# EAGLE board Schematic (EAGLE 6.4)
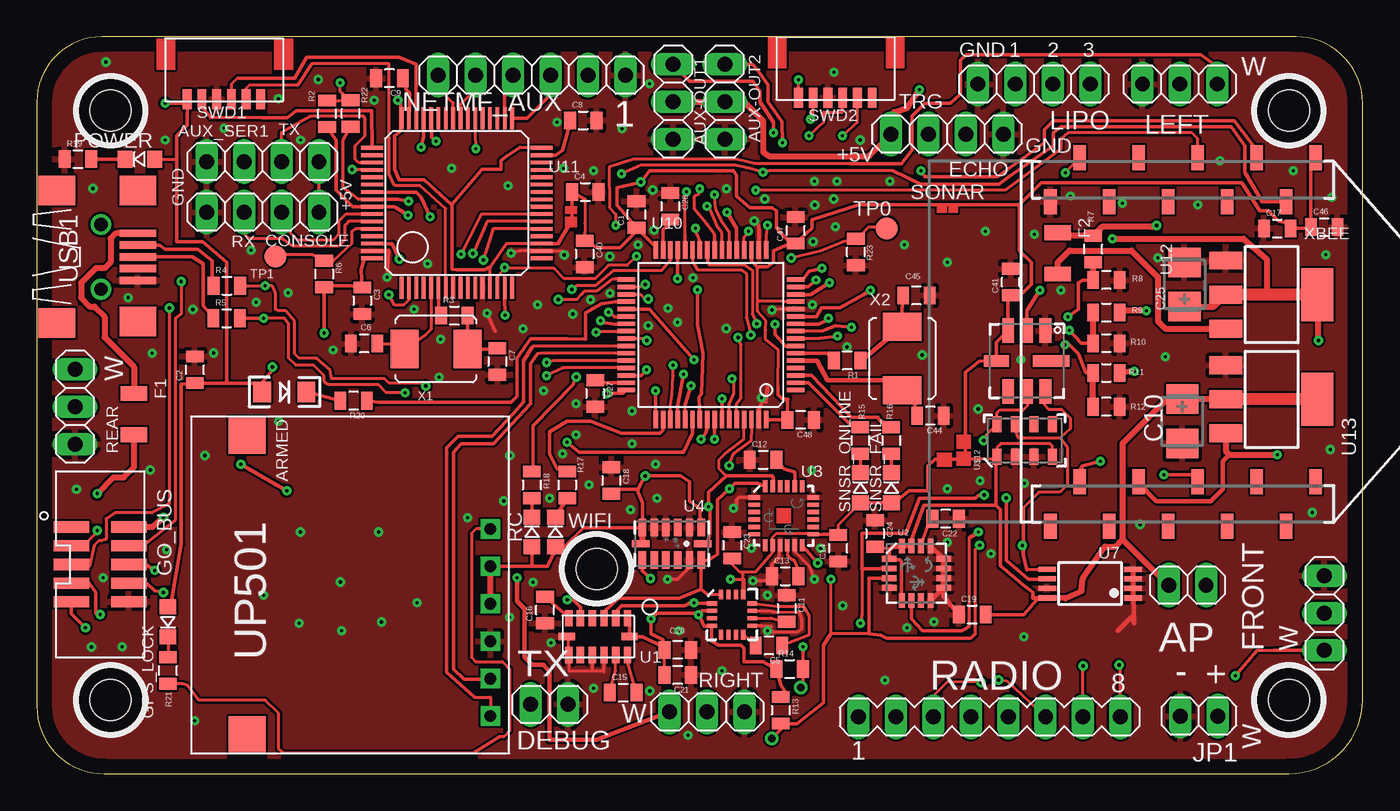
[diagram p2: board, top side]
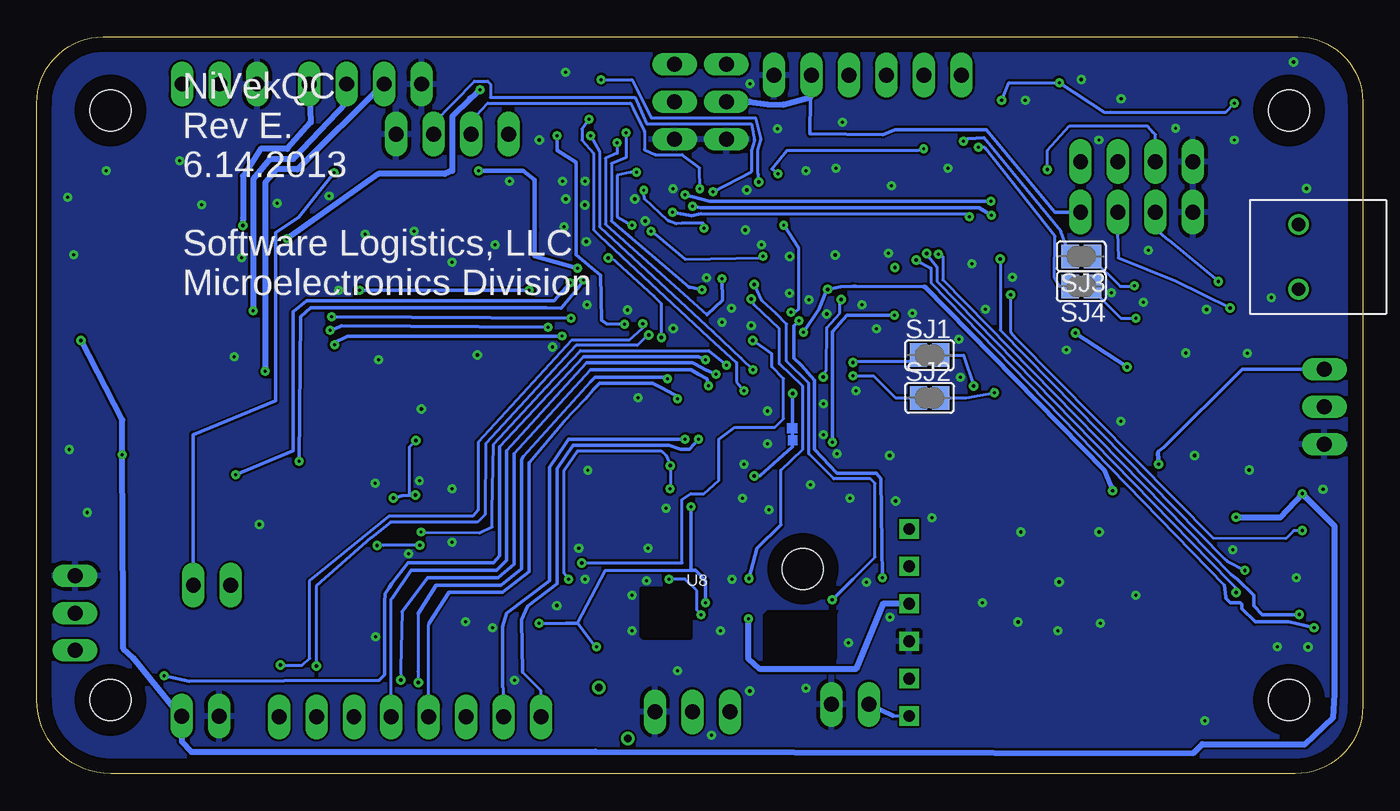
[diagram p3: board, bottom side, seen from below]

Size 90 x 50 mm. Coordinates in mm from the lower left corner, seen from the top.
Outline: 0,45.59 0,4.59 arc90 4.59,0 85,0 arc90 90,5 90,45.49 arc90 85.49,50 4.41,50 arc90 0,45.59
Copper layers (1*16): Top 0.035mm / dielectric 1.5mm / Bottom 0.035mm
Design rules "default": minimum track width 7mil, minimum drill 8mil, track to track 6mil, track to pad 6mil, pad to pad 6mil, via to via 6mil, smd to smd 6mil, copper to edge 40mil, drill to drill 8mil, minimum pad ring 10mil, minimum via ring 8mil, stop-mask expansion 4mil, vias tented up to drill 10mil, thermal gap 10mil
Holes 2.79 mm at 5,5 5,45 85,45 85,5 38,13.9

## Footprints (pad centres in the part's own frame; a part is rotated, then mirrored left to right if it is on the bottom)
1X02 = drill 1.016 long: 1 -1.27,0; 2 1.27,0
LED-1206 = smd 1.2 x 1.4: A -1.5,0; C 1.5,0
1X03 = drill 1.016 long: 1 -2.54,0; 2 0,0; 3 2.54,0
1X04 = drill 1.016 long: 1 -3.81,0; 2 -1.27,0; 3 1.27,0; 4 3.81,0
0805 = smd 0.8 x 1.2: 1 -0.9,0; 2 0.9,0
CT3528 = smd 2 x 2.2: + -1.5,0; - 1.5,0
1206L050_FUSE = smd 1 x 1.8: P$1 -1.4,0; P$2 1.4,0
PIN2ROW_0.05" = smd 2.4 x 0.76: 1 -1.95,2.54; 2 1.95,2.54; 3 -1.95,1.27; 4 1.95,1.27; 5 -1.95,0; 6 1.95,0; 7 -1.95,-1.27; 8 1.95,-1.27; 9 -1.95,-2.54; 10 1.95,-2.54
LED0805 = smd 1.143 x 1.016: C 0,1.016; P$1 0,-1.016
1X06 = drill 1.016 long: 1 -6.35,0; 2 -3.81,0; 3 -1.27,0; 4 1.27,0; 5 3.81,0; 6 6.35,0
MA08-1 = drill 1.016 long: 1 -8.89,0; 2 -6.35,0; 3 -3.81,0; 4 -1.27,0; 5 1.27,0; 6 3.81,0; 7 6.35,0; 8 8.89,0
SJ = smd 1.168 x 1.6: 1 -0.762,0; 2 0.762,0
JSTX6 = smd 0.6 x 1.35: 1 -2.495,-0.13; 2 -1.495,-0.13; 3 -0.495,-0.13; 4 0.505,-0.13; 5 1.505,-0.13; 6 2.505,-0.13
TP15R = smd 1.5 x 1.5: TP 0,0
LGA3X5X1-14L = smd 1.1 x 0.5: 1 -1.25,2; 2 -1.25,1.2; 3 -1.25,0.4; 4 -1.25,-0.4; 5 -1.25,-1.2; 6 -1.25,-2; 8 1.25,-2; 9 1.25,-1.2; 10 1.25,-0.4; 11 1.25,0.4; 12 1.25,1.2; 13 1.25,2 | smd 0.5 x 1.1: 7 0,-2.125; 14 0,2.125
LGA16-4X4 = smd 1 x 0.4: 1 -1.85,0.975; 2 -1.85,0.325; 3 -1.85,-0.325; 4 -1.85,-0.975; 9 1.85,-0.975; 10 1.85,-0.325; 11 1.85,0.325; 12 1.85,0.975 | smd 0.4 x 1: 5 -0.975,-1.85; 6 -0.325,-1.85; 7 0.325,-1.85; 8 0.975,-1.85; 13 0.975,1.85; 14 0.325,1.85; 15 -0.325,1.85; 16 -0.975,1.85
QFN-24 = smd 0.8 x 0.3: 1 -2,1.25; 2 -2,0.75; 3 -2,0.25; 4 -2,-0.25; 5 -2,-0.75; 6 -2,-1.25; 13 2,-1.25; 14 2,-0.75; 15 2,-0.25; 16 2,0.25; 17 2,0.75; 18 2,1.25 | smd 0.3 x 0.8: 7 -1.25,-2; 8 -0.75,-2; 9 -0.25,-2; 10 0.25,-2; 11 0.75,-2; 12 1.25,-2; 19 1.25,2; 20 0.75,2; 21 0.25,2; 22 -0.25,2; 23 -0.75,2; 24 -1.25,2
LGA14 = smd 0.5 x 1.2: 1 2,1.1; 2 1.2,1.1; 3 0.4,1.1; 4 -0.4,1.1; 5 -1.2,1.1; 6 -2,1.1; 8 -2,-1.1; 9 -1.2,-1.1; 10 -0.4,-1.1; 11 0.4,-1.1; 12 1.2,-1.1; 13 2,-1.1 | smd 1.2 x 0.5: 7 -2.1,0; 14 2.1,0
BMP085 = smd 1.67 x 0.8: 1 -2.065,1.27; 2 -2.065,0; 3 -2.065,-1.27; 5 2.065,-1.27; 6 2.065,0; 7 2.065,1.27 | smd 0.8 x 1.67: 4 0,-2.065 | smd 0.8 x 2.5: 8 0,1.65
TSSOP8 = smd 0.35 x 1.2: 1 -0.975,-2.925; 2 -0.325,-2.925; 3 0.325,-2.925; 4 0.975,-2.925; 5 0.975,2.925; 6 0.325,2.925; 7 -0.325,2.925; 8 -0.975,2.925
16LPCC = smd 0.65 x 0.28: 1 -1.37,0.75; 2 -1.37,0.25; 3 -1.37,-0.25; 4 -1.37,-0.75; 9 1.37,-0.75; 10 1.37,-0.25; 11 1.37,0.25; 12 1.37,0.75 | smd 0.28 x 0.65: 5 -0.75,-1.37; 6 -0.25,-1.37; 7 0.25,-1.37; 8 0.75,-1.37; 13 0.75,1.37; 14 0.25,1.37; 15 -0.25,1.37; 16 -0.75,1.37
STM32F051XXX_LPFP64 = smd 0.3 x 1.2: 1 -3.75,-5.75; 2 -3.25,-5.75; 3 -2.75,-5.75; 4 -2.25,-5.75; 5 -1.75,-5.75; 6 -1.25,-5.75; 7 -0.75,-5.75; 8 -0.25,-5.75; 9 0.25,-5.75; 10 0.75,-5.75; 11 1.25,-5.75; 12 1.75,-5.75; 13 2.25,-5.75; 14 2.75,-5.75; 15 3.25,-5.75; 16 3.75,-5.75; 33 3.75,5.75; 34 3.25,5.75; 35 2.75,5.75; 36 2.25,5.75; 37 1.75,5.75; 38 1.25,5.75; 39 0.75,5.75; 40 0.25,5.75; 41 -0.25,5.75; 42 -0.75,5.75; 43 -1.25,5.75; 44 -1.75,5.75; 45 -2.25,5.75; 46 -2.75,5.75; 47 -3.25,5.75; 48 -3.75,5.75 | smd 1.2 x 0.3: 17 5.75,-3.75; 18 5.75,-3.25; 19 5.75,-2.75; 20 5.75,-2.25; 21 5.75,-1.75; 22 5.75,-1.25; 23 5.75,-0.75; 24 5.75,-0.25; 25 5.75,0.25; 26 5.75,0.75; 27 5.75,1.25; 28 5.75,1.75; 29 5.75,2.25; 30 5.75,2.75; 31 5.75,3.25; 32 5.75,3.75; 49 -5.75,3.75; 50 -5.75,3.25; 51 -5.75,2.75; 52 -5.75,2.25; 53 -5.75,1.75; 54 -5.75,1.25; 55 -5.75,0.75; 56 -5.75,0.25; 57 -5.75,-0.25; 58 -5.75,-0.75; 59 -5.75,-1.25; 60 -5.75,-1.75; 61 -5.75,-2.25; 62 -5.75,-2.75; 63 -5.75,-3.25; 64 -5.75,-3.75
LQFP64 = smd 0.25 x 1.5: 1 -3.75,-5.75; 2 -3.25,-5.75; 3 -2.75,-5.75; 4 -2.25,-5.75; 5 -1.75,-5.75; 6 -1.25,-5.75; 7 -0.75,-5.75; 8 -0.25,-5.75; 9 0.25,-5.75; 10 0.75,-5.75; 11 1.25,-5.75; 12 1.75,-5.75; 13 2.25,-5.75; 14 2.75,-5.75; 15 3.25,-5.75; 16 3.75,-5.75; 33 3.75,5.75; 34 3.25,5.75; 35 2.75,5.75; 36 2.25,5.75; 37 1.75,5.75; 38 1.25,5.75; 39 0.75,5.75; 40 0.25,5.75; 41 -0.25,5.75; 42 -0.75,5.75; 43 -1.25,5.75; 44 -1.75,5.75; 45 -2.25,5.75; 46 -2.75,5.75; 47 -3.25,5.75; 48 -3.75,5.75 | smd 1.5 x 0.25: 17 5.75,-3.75; 18 5.75,-3.25; 19 5.75,-2.75; 20 5.75,-2.25; 21 5.75,-1.75; 22 5.75,-1.25; 23 5.75,-0.75; 24 5.75,-0.25; 25 5.75,0.25; 26 5.75,0.75; 27 5.75,1.25; 28 5.75,1.75; 29 5.75,2.25; 30 5.75,2.75; 31 5.75,3.25; 32 5.75,3.75; 49 -5.75,3.75; 50 -5.75,3.25; 51 -5.75,2.75; 52 -5.75,2.25; 53 -5.75,1.75; 54 -5.75,1.25; 55 -5.75,0.75; 56 -5.75,0.25; 57 -5.75,-0.25; 58 -5.75,-0.75; 59 -5.75,-1.25; 60 -5.75,-1.75; 61 -5.75,-2.25; 62 -5.75,-2.75; 63 -5.75,-3.25; 64 -5.75,-3.75
SOT223 = smd 1.219 x 2.235: 1 -2.311,-3.099; 2 0,-3.099; 3 2.311,-3.099 | smd 3.6 x 2.2: 4 0,3.099
UP-501 = drill 0.8 square: 1 -8.89,-8.89; 2 -6.35,-8.89; 3 -3.81,-8.89; 4 -1.27,-8.89; 5 1.27,-8.89; 6 3.81,-8.89 | smd 2.5 x 2.5: 7 10.16,7.62; 8 -10.16,7.62
MS5611-01BA = smd 1.1 x 0.6: 1 -1.1,1.875; 2 -1.1,0.625; 3 -1.1,-0.625; 4 -1.1,-1.875; 5 1.1,-1.875; 6 1.1,-0.625; 7 1.1,0.625; 8 1.1,1.875
USB-MB-S = smd 2.5 x 0.5: D+ 2.5,0; D- 2.5,0.8; GND 2.5,-1.6; ID 2.5,-0.8; VBUS 2.5,1.6 | smd 2.5 x 2: P$1 -3,-4.5; P$2 -3,4.5; P$3 2.5,-4.4; P$4 2.5,4.5 | drill 0.9: P$5 0,2.2; P$6 0,-2.2
ABRACON_ABM7_CERAMIC_XTAL = smd 1.9 x 2.6: P$1 -2.15,0; P$2 2.15,0
XBEE-SMD = smd 1.7 x 0.85: 1 -12.5,20; 2 -9.5,18; 3 -12.5,16; 4 -9.5,14; 5 -12.5,12; 6 -9.5,10; 7 -12.5,8; 8 -9.5,6; 9 -12.5,4; 10 -9.5,2; 11 12.5,2; 12 9.5,4; 13 12.5,6; 14 9.5,8; 15 12.5,10; 16 9.5,12; 17 12.5,14; 18 9.5,16; 19 12.5,18; 20 9.5,20

## Placement (x,y rotation side)
AP  [1X02]  78.1,12.8 0 top
ARMED  RED  [LED-1206]  16.8,25.9 0 top
AUX-OUT1  [1X03]  43.2,45.6 270 top
AUX-OUT2  [1X03]  46.7,45.6 270 top
AUX_SER1  [1X04]  15.34,41.54 180 top
C1  0.1uf  [0805]  40.71,37.95 90 top
C2  0.1uf  [0805]  10.73,27.41 90 top
C3  0.1uf  [0805]  22.09,32.09 270 top
C4  0.1uf  [0805]  37.24,39.47 0 top
C5  0.22uf  [0805]  49.7,8.7 180 top
C6  18pf  [0805]  22.22,29.19 180 top
C7  18pf  [0805]  31.26,27.97 270 top
C8  2.2uF  [0805]  37.09,44.33 0 top
C9  2.2uF  [0805]  23.94,47.19 180 top
C10  10uF  [CT3528]  77.76,23.91 270 top
C11  4.7uf  [0805]  50.9,11.2 270 top
C12  2.2nf (50v)  [0805]  49.3,21.3 0 top
C13  0.1uf  [0805]  50.8,13.4 0 top
C14  10nf  [0805]  54.4,15.3 90 top
C15  0.22uf  [0805]  39.8,5.5 0 top
C16  4.7uf  [0805]  34.5,11.1 90 top
C17  0.1uf  [0805]  84.2,37 0 top
C18  0.1uf  [0805]  39,19.9 270 top
C19  0.1uf  [0805]  63.5,10.8 0 top
C20  0.1uf  [0805]  43.5,8.4 180 top
C21  10uf  [0805]  43.5,6.7 180 top
C22  10nF(25V)  [0805]  61.7,17.3 180 top
C23  0.1uf  [0805]  47.2,15.5 270 top
C24  10uf  [0805]  56.9,16.3 270 top
C25  10uF  [CT3528]  77.9,33.2 90 top
C26  2.2uF  [0805]  43,38.5 270 top
C27  2.2uF  [0805]  37.9,25.8 270 top
C40  4.7uf  [0805]  37.19,35.26 270 top
C41  0.1uf  [0805]  66.11,33.36 90 top
C44  18pf  [0805]  60.66,24.29 180 top
C45  18pf  [0805]  59.71,32.45 180 top
C46  1.0uF  [0805]  87.39,37.09 0 top
C47  1.0uF  [0805]  51.51,36.87 90 top
C48  0.1uf  [0805]  51.85,24.01 180 top
CONSOLE  [1X04]  15.34,38.1 180 top
DEBUG  [1X02]  34.8,4.7 0 top
F1  1206L050_FUSE  [1206L050_FUSE]  6.6,24.4 270 top
F2  1206L050_FUSE  [1206L050_FUSE]  69.3,35.3 270 top
FRONT  [1X03]  87.4,10.9 90 top
GO_BUS  GO!BUS  [PIN2ROW_0.05"]  4.3,14.2 0 top
GPS_LOCK  BLUE  [LED0805]  8.9,10.3 180 top
JP1  [1X02]  78.89,3.91 180 top
LEFT  [1X03]  77.6,46.8 180 top
LIPO  [1X04]  67.7,46.8 180 top
NETMF_AUX  [1X06]  33.6,47.4 180 top
POWER  ORANGE  [LED0805]  7,41.7 90 top
R1  390  [0805]  55.02,28.04 180 top
R2  10K  [0805]  19.71,44.78 90 top
R3  390  [0805]  28.35,31.09 0 top
R4  22  [0805]  12.9,33.11 0 top
R5  22  [0805]  12.89,30.91 0 top
R6  10K  [0805]  19.5,33.9 270 top
R7  50K  [0805]  71.7,35.6 90 top
R8  10K  [0805]  72.6,33.5 180 top
R9  30K  [0805]  72.6,31.3 0 top
R10  10K  [0805]  72.6,29.2 180 top
R11  10K  [0805]  72.6,27.2 0 top
R12  10K  [0805]  72.6,24.9 180 top
R13  4.7K  [0805]  50.5,4.3 270 top
R14  4.7K  [0805]  51.1,7.1 0 top
R15  470  [0805]  55.9,22.6 270 top
R16  470  [0805]  58,22.6 270 top
R17  470  [0805]  36,19.6 270 top
R18  470  [0805]  33.6,19.6 270 top
R19  470  [0805]  2.8,41.7 0 top
R20  470  [0805]  21.5,25.3 180 top
R21  470  [0805]  8.9,7 90 top
R22  10K  [0805]  21.3,44.8 90 top
R23  10K  [0805]  55.6,35.4 90 top
RADIO  [MA08-1]  64.67,3.86 0 top
RC  BLUE  [LED0805]  33.6,16.4 0 top
REAR  [1X03]  2.6,24.9 270 top
RIGHT  [1X03]  45.5,4.2 0 top
SJ1  [SJ]  29.4,28.4 0 bottom
SJ2  [SJ]  29.4,25.5 0 bottom
SJ3  [SJ]  19.1,35.1 180 bottom
SJ4  [SJ]  19.1,33.07 180 bottom
SNSR_FAIL  RED  [LED0805]  58,19.4 0 top
SNSR_ONLINE  BLUE  [LED0805]  55.9,19.4 0 top
SONAR  [1X04]  61.8,43.4 180 top
SWD1  JST-6PIN  [JSTX6]  12.7,45.9 0 top
SWD2  SWD-STM32F0  [JSTX6]  54.2,46 0 top
TP0  TPTP15R  [TP15R]  57.7,37 0 top
TP1  TPTP15R  [TP15R]  16.2,35.1 0 top
U1  LSM303DLHC  [LGA3X5X1-14L]  38.1,9.3 270 top
U2  L3G4200D  [LGA16-4X4]  59.7,13.6 0 top
U3  ITG-3200  [QFN-24]  50.7,17.5 0 top
U4  ADXL345  [LGA14]  43.1,15.6 0 top
U5  BMP085  [BMP085]  67.2,28 270 top
U7  24AA128ST  [TSSOP8]  71.5,12.9 90 top
U8  HMC5883LSMD  [16LPCC]  47.2,10.8 0 top
U10  STM32F051XXX  [STM32F051XXX_LPFP64]  45.76,29.78 90 top
U11  STM32F40X  [LQFP64]  28.51,38.72 0 top
U12  LM1117MP-3.3  [SOT223]  83.82,32.51 270 top
U13  LM1117MP-3.3  [SOT223]  83.82,25.4 270 top
U$4  UP501  [UP-501]  21.9,12.8 90 top
U$12  MS5611-01BA  [MS5611-01BA]  67.06,22.61 90 top
USB1  DX2R005HN2E700  [USB-MB-S]  4.36,35.07 0 top
WIFI  GREEN  [LED0805]  35.2,16.4 0 top
X1  ABRACON_ABM7  [ABRACON_ABM7_CERAMIC_XTAL]  27.1,28.81 0 top
X2  ABRACON_ABM7  [ABRACON_ABM7_CERAMIC_XTAL]  58.74,28.17 90 top
XBEE  XBEE-1B3  [XBEE-SMD]  66.8,29.3 270 top

## Tracks (layer width: path | path; a pad name or v marks a point on that pad's centre or on a via)
+3V3  (via drill 0.2, 0.23)
  Top 0.2: 47.9,13.7 47.95,13.45 U8.13 47.97,12.17 48,12.2 48,13.2 v47.1,13.2 | 47.9,13.7 48.8,13.7 50,15.1 50,15.45 U3.8 49.95,16.05 50.2,16.3 52.65,16.3 U3.13 53.35,16.25 | C23.2 47.1,14.3 47.7,13.7 47.9,13.7 | 40.71,37.09 C1.1 40.71,36.81 | 10.2,44.8 SWD1.1 10.2,45.7 10,45.5 v8.7,45.5 | SWD2.1 51.7,46.99 v51.7,47.1 | SNSR_FAIL.P$1 58,18.2 | 8.83,11.33 8.9,11.4 GPS_LOCK.P$1 | R2.2 20.48,45.68 R22.2 20.6,46.3 v20.6,46.9 | 37.2,38.98 37.2,37.36 C40.1 37.2,36.25 37.2,36.2 37.3,36.2 | U10.32 42.01,35.75 | 37.2,16.7 37.1,16.7 35.78,15.38 WIFI.P$1 35.21,15.39 35.31,15.39 | 45.15,11.05 v44.9,10.8 | C21.2 42.6,8.3 | C24.2 57.7,15.3 57.85,15.15
  Top 0.203: 50.3,26.3 50.34,28.75 49.45,29.49 49.47,30.1 49.48,30.73 48.92,31.39 48.92,32 | 48.92,32 48.92,34.38 48.9,34.4 | 68.03,11.93 67.6,11.9 67.9,11.8 | POWER.P$1 9.5,41.7 | U11.19 31.87,35.97 30.8,34.4 30.76,34.24 U11.13 | C14.2 54.4,16.88 SNSR_ONLINE.P$1 | 50,34.7 49.99,34.7 49.97,34.69 | 50.69,32.05 48.97,32.05 48.92,32 | U$12.4 68.93,22.25 68.78,22.4 65.43,22.4 65.18,22.15 U$12.1 65.18,21.46 65.1,21.38 | 63.07,21.31 63.06,21.33 63.05,21.34 63.05,21.79 63.04,21.79
  Top 0.24: C47.1 51.23,35.97 50.2,37 50.2,38.2 49.9,38.4 48.4,38.4 47.5,39.2 47.5,40.6 47.3,40.9 | C47.1 51.01,35.91 50,35.5 50,34.7 | 50.69,32.05 U10.13 | 32.79,42.5 U11.32 | 22.2,34.9 22,34.18 C3.1 | C48.2 49.71,24.01 | U10.64 49.53,24.01 49.71,24.01 | C4.1 37.2,38.98 | C20.2 42.9,8.3 42.6,8.3 42.5,8.6 41.1,9.3 | U$4.5 33.6,14.07 34.67,14.07 35.31,15.39 | U4.6 37.2,16.7 | U2.15 59.38,15.88 60.2,18.2 64.3,18.2 | 65.4,17.9 65.4,14.1 67.1,12.7 67.2,12.6 67.6,12.3 67.6,11.9 67.9,11.8 67,10.8 65.1,10.8 C19.2 | 63.04,21.79 63.04,21.89 63.04,24.1 63.04,27.25 63.35,27.49 63.98,28 64.9,28.05 65.1,28 U5.4 | U5.3 65.93,32.28 C41.1 66.15,32.5 66.8,32.5 67.5,33.2 67.5,34.7 66.7,35.5 66.7,38.6 55.8,38.6 52.6,37.6 52.6,37 51.5,36 C47.1 | 44.3,19.8 43.7,20.2 v41.3,20.2 40.8,19.3 38.8,19.3 C18.2 | 49.5,23.8 49.71,24.01 | 45.8,10 45.8,9 46.3,8.7 47.8,8.7 48,8.5 48,7.6 49.3,7.6 R14.1 50.5,6 51,5.3 R13.1 | 50.3,26.3 50.3,25.7 50.6,25.4 51,25.4 | 53.35,16.25 53.95,16.25 C14.2 | 44.9,10.9 42.1,10.9 v41.7,10.5
  Top 0.254: 41.1,9.3 U1.14 40.23,10.43 U1.1 | 45.78,10 45.3,10 44.9,10.9 45.15,11.05 U8.2 | 45.8,10 45.78,10 | 45.78,10 U8.4 | U4.6 41.1,18.4 40.8,19.1 40.8,19.3 | 44.3,19.8 44.3,18.5 45,18 45,17.4 45.1,17.3 U4.1 | U5.4 65.14,29.27 U5.3 | U11.19 35.37,35.97 36.32,37.58 C4.1 36.4,39.33 | 66.7,38.6 68.2,40.1 81.7,40.1 81.8,40.1 83,38.2 83.6,38.2 84.3,37.5 84.8,37.4 85.1,36.9 C17.2 | v41.7,10.5 41.7,9.5 42.5,9.1 42.5,8.6 | C48.2 50.95,25.35 51,25.4 | SNSR_ONLINE.P$1 SNSR_FAIL.P$1 | RC.P$1 33.6,14.07 | 40.71,37.09 39.4,38.56 39.4,39.76 39.5,39.8 v41,40.15 41.6,40.9 43.1,40.9 44.4,40.9 45.6,40.9 45.9,40.9 46.6,40.9 47.3,40.9 | 58,18.2 59.2,19.2 60.5,19.2 60.5,20.88 60.96,21.34 63.05,21.34 | 40.71,36.81 39.6,35.7 38.1,35.7 38,35.7 37.3,36.2 | 42.01,35.75 C1.1 | 32.79,42.5 31.9,41.9 31.6,41.7 31.5,41.6 31.5,41 30.24,41 28.16,38.62 | U7.8 68.03,11.93 67.78,11.93 | v24.5,45.7 24.7,45.5 24.7,44.5 24.73,44.5 U11.48 24.7,44.41 24.7,43.6 24.3,43.3 24.3,41 24.6,40.3 25.3,40.3 26.3,40.3 28.16,38.62 | U11.64 22.67,34.97 22.2,34.9 | 8.9,11.4 9.1,11.4 9.8,15.6 9.8,26.44 C2.1 12.9,26.51 | C17.2 86.4,37 C46.1 86.49,41.49 XBEE.1 | C17.2 | 65.4,17.9 65.1,18.2 | 65.1,18.2 65.1,19.35 65.1,21.38 63.06,21.33 | 64.3,18.2 64.9,18.2 65.1,18.2 | 28.16,38.62 28.2,38.6 28.2,34.24 28.5,34.2 30.4,34.2 30.8,34.4 | 19.6,33 19.5,32.8 19.5,31.4 19.5,30.8 19.5,30.6 v19.5,29.89 | 19.6,33 19.8,33 | 19.6,33 | 19.8,33 19.5,33.1 | 19.5,33.1 19.4,33.1 | R6.2 19.2,33 19.8,33 | 19.5,33.1 21.3,33.1 C3.1 | 10.2,44.7 10.2,44 9.5,43.3 9.5,41.7 9.49,41.4 9.49,36.1 11.25,36.1 12.9,34.7 12.9,29.2 12.9,26.51 | 10.2,44.7 10.2,44.8 10.2,44.7 | 10.2,44.7
  Top 0.254: U2.5 58.7,11.75 58.7,14.4 58.6,14.5 58,14.5 57.9,14.6 57.88,14.6 U2.1 | v38.7,25.8 39.8,25.8 40.01,26.01 U10.48 | 12.9,26.51 15.27,26.51 | 15.27,26.51 ARMED.A | 15.27,26.51 15.97,27.37 v16,27.6 | U10.19 48.51,34.79 48.9,34.4 49.6,34.4 49.97,34.69
  Top 0.305: U2.1 57.85,15.15 58.1,15.4 58.67,15.4 U2.16 U2.15
  Top 0.406: 86.7,41.7 XBEE.1 | 10.5,26.38 C2.1 | U7.8 69.85,11.9 70.91,12.38 71.01,13.25 72.5,15.4 73.2,15.4 73.7,15.9 | U$4.4 U$4.5 | U4.7 41.1,15.6 41.1,16.6 | 41.1,16.6 | 41.1,16.6 U4.6 | U13.2 77.8,25.4 | 77.8,25.4 | 77.8,25.4 77.7,25.3 76.6,25.3 73.7,22.4 73.7,15.9 | C10.+ 77.79,25.41 77.8,25.4 | 73.7,15.9 | 73.7,15.9 76.8,12.8 AP.1
  Top 0.813: U13.4 U13.2
  Bottom 0.2: v51.7,47.1 49.6,47.1 48.3,44.5 41.2,44.5 40.85,43 | v20.6,46.9 17.55,44.9 17.1,44.9 9.3,44.9 v8.7,45.5 | v44.9,10.8 45.2,11.1 45.2,12.4 46,13.2 v47.1,13.2
  Bottom 0.203: v24.5,45.7 24,46.9 20.7,46.9 v20.6,46.9 | v41,40.15 41,40.64 41.05,40.69 41.05,42.35 40.85,43
  Bottom 0.254: v41.3,20.2 40.9,20.2 38.7,22.2 38.7,25.6 38.9,25.8 v38.7,25.8 | v16,27.6 v19.5,29.89
  Bottom 0.406: U$4.4 32.57,11.53 34.4,7.1 40.9,7.1 41.7,7.8 v41.7,10.5
+5V  (via drill 0.2, 0.23)
  Top 0.2: SONAR.4 57.99,44.09
  Top 0.203: SONAR.4 | SONAR.4 | XBEE.14 74.8,19.7 | CONSOLE.1 19.15,41.45 19.2,41.5 19.19,41.5 AUX_SER1.1
  Top 0.254: AUX-OUT2.2
  Top 0.305: 74.8,19.7 76,18.5 79.7,18.5 80.5,19.3 80.5,21.2 80.95,21.65
  Top 0.406: v73,36.3 81.9,36.3 83.5,34.9 83.5,32.71 83.7,32.51 | 57.99,44.09 58.2,44.9 59.1,45.2 v59.9,46.4 | v4.1,19 5.2,20.1 5.9,20.1 6.6,20.8 F1.P$2 | AUX-OUT1.2 AUX-OUT2.2 48,45.6 49.3,44.3 49.3,42.2 49.7,41.9 56.5,41.9 SONAR.4 | GO_BUS.2 7.85,16.75 v8.6,17.4 | v4.1,19 | C25.+ 79.91,31.7 U12.2 | v87,29.4 87,32.43 U12.4 | U13.3 80.72,21.88 80.95,21.65 v84.2,21.66 | F1.P$2
  Top 0.813: U12.4 83.7,32.51 U12.2 | U12.2 80.7,32.5 U12.2
  Bottom 0.254: CONSOLE.1 19.4,38.1 20.9,38.1 21.4,38.7 25.55,43.7 26.5,43.7 27.5,43.7 30,43.7 31.75,43.7 32.55,43.37 37.5,43.42 37.5,45.8 37.5,45.9 | 37.5,47.4 37.5,47.3 37.47,47.33 NETMF_AUX.2
  Bottom 0.406: v73,36.3 66.8,40.7 62.3,40.7 61.8,40.9 61.8,44.6 60.6,45.8 v59.9,46.4 | AUX-OUT1.2 41.9,45.6 42.12,45.61 41.62,45.61 40.39,45.41 39.35,45.4 37.5,45.9 37.5,47.3 37.5,47.37 NETMF_AUX.2 | v8.6,17.4 5.6,17.4 v4.1,19 1.9,16.8 1.9,5.4 2,3.8 3.9,2 10.9,2 11.5,1.4 52.1,1.5 57.13,1.49 57.16,1.47 79.5,1.47 80.16,2.18 JP1.1 80.16,3.8 80.14,3.77 83.47,7.86 84.13,8.49 84.14,11.11 v84.2,21.66 84.2,24 v87,29.4
+5VREG
  Top 0.406: USB1.VBUS 5.37,36.67 5,36.3 5,34.7 4.6,34.3 4,34.3 3,33.3 3,32.3 3.6,31.7 3.9,31.7 4.6,31 4.6,29.6 6.6,27.6 F1.P$1 | 6.6,25.7 F1.P$1 | F1.P$1
ADC_CELL1  (via drill 0.2)
  Top 0.24: R11.1 71.2,27.2 70.7,28.5 69.9,29.3 v69.8,29.1 | v54.35,29.7 53.15,29.55 U10.8
  Top 0.406: R12.2 R11.1
  Bottom 0.24: v69.8,29.1 69.9,29.2 68.9,29.7 v54.35,29.7
ADC_CELL2  (via drill 0.2)
  Top 0.24: R10.2 70.9,29.2 v70.1,30.1 | v55.3,30.3 54.22,30.4 53.37,30.05 U10.9
  Top 0.406: R9.1 R10.2
  Bottom 0.24: v70.1,30.1 70.2,30 69.3,30.4 v55.3,30.3
ADC_CELL3  (via drill 0.2)
  Top 0.24: R8.2 71,33.5 70.7,33.3 70.7,31.5 v70,31 | v53.75,30.9 53.6,30.8 53.56,30.75 53.06,30.5 51.51,30.51 | U10.10 51.51,30.51 | 51.51,30.51 51.5,30.5
  Top 0.406: R7.1 R8.2
  Bottom 0.24: 70.2,31 v70,31 v53.75,30.9
ADXL_IRQ  (via drill 0.23)
  Top 0.203: v41.5,32.2 41.3,32.2 41,32.5 40.04,32.5 U10.35
  Top 0.254: U4.8 | U4.8 41.1,13.77 v41.66,13.25
  Bottom 0.203: 39.5,16.9 39.5,20.6 38,22 38,26.3 39.6,27.8 39.6,30.2 41.3,31.8 v41.5,32.2
  Bottom 0.254: v41.66,13.25 41.1,15.3 39.5,16.9
BMP_EOC  (via drill 0.2)
  Top 0.254: U5.2 67.2,31.4 v68.1,32.8 | v56.6,32.8 56.1,32.5 54.5,31.6 53.25,31.6 52.91,31 51.54,31 U10.11
  Bottom 0.254: v68.1,32.8 v56.6,32.8
F0_RESET  (via drill 0.2)
  Top 0.2: 55.7,44.2 SWD2.5
  Top 0.203: 55.7,44.2 v54.7,43.3
  Top 0.24: v50.1,30.5 50.1,29.8 50.81,29 51.48,29 U10.7
  Bottom 0.24: v54.7,43.3 54.7,42.3 53.4,41.5 53.4,35.2 51.73,33.83 51.66,30.79 51.32,30.52 v50.1,30.5
F0_SWCLK  (via drill 0.2)
  Top 0.2: v52.5,44.4 52.7,44.6 52.7,45.8 | 52.7,45.8 52.7,45.9 | SWD2.2 52.7,45.8
  Top 0.24: v42,26 U10.49
  Bottom 0.2: 51.8,36.5 44.4,29.6 42.5,27.9 42.5,26.6 v42,26
  Bottom 0.203: v52.5,44.4 53,43.74 53,43 52.2,42.1 52.2,36.9 51.8,36.5
F0_SWDIO  (via drill 0.2)
  Top 0.2: 53.4,44.9 54.7,44.9 SWD2.4
  Top 0.203: 53.4,44.9 53.4,44.2 v52.4,43.3
  Top 0.24: v41.4,27.4 41,27 40.04,27 U10.46
  Bottom 0.2: 51.8,37.1 44.1,30 42.2,28.2 v41.4,27.4
  Bottom 0.203: v52.4,43.3 51.8,42.2 51.8,37.1
F4_DBG_IN  (via drill 0.23)
  Top 0.2: U11.59 21.17,37.47 21.1,37.4 20.9,37.2 20.9,36.4 20.9,36.2 20.5,35.8
  Top 0.203: 20.5,35.8 17.4,35.8 16.7,36.3 14.4,36.3 14,36.7 14.07,36.77 CONSOLE.3 | v9.8,33.4 9.8,31.2 9.4,30.9 9.4,17.2 7.5,15.7 6.2,15.4 6.2,15.42 GO_BUS.4
  Bottom 0.203: v9.8,33.4 13.15,36.2 14,36.9 14,38.03 CONSOLE.3
F4_DBG_OUT  (via drill 0.23)
  Top 0.203: v9,31.6 9,18.3 7.8,17.7 5.3,17.7 4.7,17.3 4.7,15.9 4.4,15.8 4.2,15.8 3.9,15.5 3.6,14.1 2.5,14.1 | 2.5,14.1 2.4,14.1 2.3,14.2 | GO_BUS.5 2.4,14.2 2.5,14.1 | U11.58 20.97,37.97 20.5,37.5 20.5,36.6 20.1,36.2 17.7,36.2 17.2,36.7 17.2,37.5 CONSOLE.2 | CONSOLE.2
  Bottom 0.203: v9,31.6 12.72,33.44 16.6,35.01 16.64,36.74 16.64,38.07 CONSOLE.2
F4_RESET#
  Top 0.203: U11.7 27.76,38.34 26,39.9 24.3,39.9 23.9,40.7 23.9,48.2 18.7,48.2 17.7,46.7 14.4,46.7 14.2,46.5 SWD1.5
F4_SWCLK
  Top 0.2: 15.3,44.5 11.8,44.5 11.2,45.3 SWD1.2 | 11.2,45.8 SWD1.2 | SWD1.2
  Top 0.24: 15.3,44.5 16.4,44.5 17,44.5 17.4,44.8 17.6,45 22.73,45 U11.49
F4_SWDIO
  Top 0.2: 13.7,47.2 13.6,47.2 13.2,46.8 SWD1.4
  Top 0.24: U11.46 25.76,48.14 24.6,48.6 18.3,48.6 17.5,47.2 13.7,47.2
GND  (via drill 0.2, 0.23)
  Top 0.2: 50.4,14.7 50.4,14.95 50.5,15.45 U3.9 | 36,35.4 35.77,35.47 U11.18 32.77,35.47 v32.2,35.3 | U8.11 49.75,11.05 50,11 51.75,10.95 51.9,10.5 51.9,9.8 51.6,9.6 50,9.6 | v49.6,9.7 49.9,10 49.2,10 | U1.7 36,9.3 36.1,9.2 U1.8 36.1,7 37.7,7 | 37.7,7 38.4,7 38.5,6.9 U1.11 | U1.10 37.7,7
  Top 0.203: U3.11 51.45,15.05 52,14.5 52.4,14.1 v52.8,13.2 | U10.12 49.96,31.53 v49.9,31.47
  Top 0.24: 31.1,30.03 v30.58,31.25 | U11.63 23.87,35.47 v23.78,33.68 | U3.1 47.65,18.75 47.5,18.6 47.5,18.2 v47.3,18
  Top 0.254: U10.63 49,24.7 49.6,25.9 49.6,26.3 49.5,25.2 v49.2,25.5 | v48.6,13.1 49.8,13.1 49.9,13.3 49.9,14.2 50.4,14.7 | v42.8,13.2 43.5,13.2 44.3,14 U4.12 | U4.12 | U8.9 49.15,10.05 49.2,10 | 49.2,10 | 49.2,10 | v49.6,9.7 49.9,9.7 50,9.6 | U10.18 49.01,37.19 v48.7,37.5
  Top 0.305: 73.39,9.71 74.29,10.61 74.5,10.2 U7.1 U7.2 U7.3 U7.4 | U2.8 U2.9 | U2.9 U2.10 U2.11 U2.12 U2.13 | U2.9 61.55,12.05 C19.1 | 47.9,3.24 RIGHT.3
  other vias: 20.7,9.7 40.3,17.9 17.9,43 7.85,28.52 26.52,34.6 42.1,18.7 46.8,39.7 35.75,41.07 61.8,19.33 64.4,36.8 61.8,15.7 59.06,9.9 17.8,10.2 44.2,2.6 49.6,12.1 57.9,40.2 54.2,37.1 58.9,35.9 32,39.9 14.9,32 54.1,47.6 29.24,17.37 32.1,10.6 34.9,8.9 37.8,5.8 33.7,13 27.3,26.9 80.3,41.6 85.3,40.9 40.8,35.9 43.49,30.64 54.3,40.2 70.14,39.2 78.8,38.6 61.8,34.7 76.6,28.3 87.5,35.2 8.7,43 16.4,23.9 15.4,12.1 37.5,19.6 34,31.83 40.4,22.4 42,21 43.6,9.7 46.5,7 67.02,19.7 12.7,43.8 14.55,35.5 17.05,32.63 20.1,28.75 55.9,43 23.2,16.4 20.6,13 74.9,16.9 86.58,17.71 87.8,22 3.7,8.6 5.8,8.6 2.7,19.3 49.4,39 54.1,39 41.8,39.6 37.79,40.91 42.85,31.59 38.9,35.1 35.8,35.2 41.6,5.6 54.7,11.4 16.4,45.8 19.1,47.1 22.9,45.7 6.2,32.3 10.6,31.5 12,28.54 54.99,28.96 60.1,28.4 63.9,24.75 23.4,10.3 67,9.3 60.9,10.3 64.75,14.91 41.5,30.4 46.8,30.2 53.2,15.3 52.7,36.1 52.8,38.6 52.8,40.2 44.54,33.64 34.4,26 76.1,35 73.7,38.7 40.4,24.6 52.6,20.6 48.5,15.3 33,30.2 37.6,32.15 38.9,32.6 36.6,23 35.7,21.7 36.6,25.1 34.8,18.7 25.6,31.5 27.4,29.5 4.5,13.3 8.8,15.2 41.9,36.9 35.3,44.2 87.9,39.1 69.5,32.8 67.7,36.6 66.8,28.1 3.8,39.7 4.7,48.3 17.9,16.4 25.8,11.6 10.7,3.6 11.4,21.6 7.7,20.6 39.71,43.76 28.14,41.07 31.7,18.5 32.1,21.6 41.59,46.81 52.66,31.8 57.58,6.34 64.03,19.89 36.37,31.19
  pour Top: 0.5,49.4 89.4,49.5 89.8,0.5 0.4,0.9 0.5,4.1
  pour Bottom: 0.7,49.3 89.4,49.3 89.4,0.6 0.4,0.8 0.4,1.3
GO_IRQ  (via drill 0.23)
  Top 0.203: U11.2 25.26,32.16 24.9,31.8 24.3,31.8 v23.9,32.5 | GO_BUS.3 3.17,15.47 3.9,16.2 v4.1,16.5
  Bottom 0.203: v23.9,32.5 23.9,30 23.5,29.5 10.14,15.99 5.23,15.95 4.68,16.5 v4.1,16.5
GO_MISO  (via drill 0.23)
  Top 0.203: U11.22 30.57,37.47 v29.6,35.3
  Top 0.254: v8.6,12.3 8,12.4 7.5,12.9 6.28,12.9 GO_BUS.8
  Bottom 0.203: v29.6,35.3 28.9,34.4 28.9,33.4 9,13 8.6,12.6 v8.6,12.3
GO_MOSI  (via drill 0.23)
  Top 0.203: U11.23 30.17,37.97 v28.8,35.25
  Top 0.254: GO_BUS.7 3.57,12.93 4,12.3 4,10.9 v4.3,10.8
  Bottom 0.203: v28.8,35.25 28.5,35.1 28.5,33.5 8.9,13.5
  Bottom 0.254: 8.9,13.5 8.5,13.2 7.4,12.1 7.4,11.4 6.8,10.8 v4.3,10.8
GO_SCK  (via drill 0.23)
  Top 0.203: U11.21 30.97,36.97 v30.3,34.85
  Top 0.254: GO_BUS.9 2.35,10.85 v3.3,9.9
  Bottom 0.203: v30.3,34.85 29.3,34.3 29.3,33.3 9.4,12.8
  Bottom 0.254: v3.3,9.9 5,10.3 7.3,10.3 8.2,11.2 8.2,11.5 8.3,11.6 9,11.6 9.3,11.9 9.3,12 9.4,12.8
GO_SS  (via drill 0.23)
  Top 0.254: U11.62 24.13,35.97 v24.6,34.94 | v8,13.8 7.35,14.2 | 6.2,14.2 7.35,14.2 | 7.35,14.2 GO_BUS.6
  Bottom 0.203: v24.6,34.94 24.6,30.1 9.4,14.6 9.2,14.4 v8,13.8
GROUND_MASK
  cutout Bottom: 45.6,12.7 49,12.7 49.1,12.6 49.1,9.3 48.9,9.1 45.6,9.1 45.5,9.2 45.5,12.2
HCSR04_ECHO  (via drill 0.2)
  Top 0.203: 44.01,36.59 44,37.2 44,39.4 44.2,39.5 v44.1,39.5
  Top 0.254: 44.01,36.59 U10.28
  Bottom 0.2: SONAR.2 63.07,44.13 60.3,47 59.4,47 59.2,46.8 59.2,45.9 49.4,45.9 48.6,44.1 41.5,44.1 41.3,43 41.5,42.3 41.49,40.85 v44.1,39.5
HCSR04_TRIGGER  (via drill 0.2)
  Top 0.2: 44.9,39.3 v45,39.7
  Top 0.203: 46.01,36.49 46.01,36.59 45.45,37.3 44.65,38.3 44.65,39.2 44.9,39.3 | 44.9,39.3
  Top 0.254: 46.01,36.49 U10.24
  Bottom 0.2: SONAR.3 60.53,44.27 59.4,45.5 49.7,45.5 49.5,45.1 48.75,43.55 48.75,42.35 48,42 46.2,42 45,41.1 v45,39.7
I2C1_SCL  (via drill 0.2, 0.23, 0.51)
  Top 0.2: 56,13.9 56,10.8 v55.9,10.2
  Top 0.203: 46.8,20.2 46.6,20.4 46.3,20.7 46.3,21.3 46.7,21.7 48,22.7 U10.61 | v64.26,22.61 64.26,22.79 U$12.8 65.18,24.49 65.38,24.69 66.95,24.69 67.26,24.99 67.26,25.88 U5.6
  Top 0.24: 43.98,11.4 44.48,11.62 v44.6,11.6 | v52,8.6 R14.2 | 56,13.9 57.3,13.9 57.27,13.93 | 65.8,14.5 v65.8,18.7
  Top 0.254: U1.2 39.4,11.1 39.7,11.4 43.98,11.4 44.2,11.5 44.25,11.55 U8.1 | 65.8,14.5 67.3,13.2 68.05,13.2 U7.6 | U4.14 45.5,15.6 45.7,16.3 45.7,18.2 v45.6,18.1 45.6,19.1 46.8,20.2 49.9,20.2 50,20.05 U3.23 | U2.2 57.27,13.93 56,13.9 56,16.3 59,16.3 59.9,18.7 63.7,18.7 63.9,18.9 v64.3,18.9 | R14.2 52,5.97 v51.87,5.84
  Bottom 0.2: v55.9,10.2 54.1,10.2 53.3,10.2 51.4,13.8 45.6,13.8
  Bottom 0.203: v52,8.6 52.3,8.9 53.3,10.2 54.1,10.2 | 54.1,10.2 | 64.7,18.9 64.7,22.17 v64.26,22.61
  Bottom 0.24: v44.6,11.6 44.6,13.1 45.3,13.8 45.6,13.8 v45.6,18.1
  Bottom 0.254: v65.8,18.7 65.21,18.85 64.7,18.9 v64.3,18.9
I2C1_SDA  (via drill 0.2, 0.23, 0.51)
  Top 0.2: 56.5,9.5 53.9,9.5 v53.9,13.2
  Top 0.203: 63.7,9.5 63.7,15.2 v64,15.5 | v66.9,15.49 66.91,15.49 66.91,15.44 66.96,14.8 | U10.62 48.51,23.01 48.5,22.6 47.3,21.7 v47,20.9 | U$12.7 66.43,23.23 66.6,22.81 69.49,22.81 | 69.49,22.81 69.95,22.2 69.95,19.61 69.44,19.1 68.01,19.1 66.96,18.05 | 68.4,25.3 68.4,25.02 68.68,24.74 69.55,24.74 70.16,24.13 70.16,23.42 69.49,22.81
  Top 0.24: R13.2 51.6,3.4 53.4,4.8 53.4,8.7 53.9,9.5 | 46.2,18.2 46.2,18.6 46.92,19.22 v47.03,19.32
  Top 0.254: U8.16 45.55,12.15 45.1,12.5 | U1.3 38.5,11 39.5,11.9 43.6,11.9 45.1,12.5 | 45.1,12.5 U4.13 45.6,14.5 46.2,14.9 46.2,18.2 | U5.7 68.4,25.3 | 66.96,18.05 66.96,14.8 67.2,13.85 U7.5 68.45,13.9 68.7,13.9 | v47.03,19.32 47.4,19.7 48.9,19.7 U3.24 | U2.3 56.48,13.28 56.5,9.5 57.3,9.4 57.7,9.2 63.4,9.2 63.7,9.5 | R13.2 50.5,3 v49.89,2.39
  Bottom 0.2: v53.9,13.2 54.2,13.6 54.2,20.6 53.3,21.9 47.6,21.9
  Bottom 0.203: v64,15.5 66.45,15.5 66.65,15.49 v66.9,15.49 | 47.6,21.9 47.5,21.8 47.3,21.6 v47,20.9 47,19.3 47.01,19.3 v47.03,19.32
I2C3_SCL
  Top 0.203: U11.41 28.26,45.5 27.23,46.53 27.23,47.4 NETMF_AUX.6
I2C3_SDA
  Top 0.203: U11.40 28.76,45.42 29.52,46.18 29.52,47.12 NETMF_AUX.5
ITG3200_IRQ  (via drill 0.23)
  Top 0.203: v41.4,29.4 41.3,29.5 40,29.5 U10.41
  Top 0.254: U3.12 v53,14.3
  Bottom 0.203: v53,14.3 46.2,14.3 46.2,18.6 45.6,19 44.7,19 43.7,19.9 43.7,22.7 42.6,23.5 39.9,23.5 39.3,24.1 39.3,26.8 40.1,27.6 40.1,28.5 v41.4,29.4
L3GD20_IRQ  (via drill 0.2)
  Top 0.203: 62.8,9.7 63.3,10 63.3,16 | U10.51 43.01,24.99 43.1,25.7 43.2,27 v43.2,27.7
  Top 0.254: U2.6 59.38,10.53 60.1,9.7 62.8,9.7 | 63.3,16 v63.9,16.4
  Bottom 0.2: 53.1,28.7 44.4,28.7 v43.2,27.7
  Bottom 0.203: v63.9,16.4 59.96,16.34 59.09,16.74 59.1,17.8 59,22.35 55.4,26.25 53.1,28.7
LED_GPS_SIGNAL
  Top 0.2: U$4.6 29.81,16.61 29.5,16.3 29.5,7.9 29.8,7.6 31.6,7.6 32.1,7.1 32.1,2.9 31.7,2.5 31.4,2.5 29.6,1.4 16.8,1.4 16.4,1.7 16.4,4.1 15.5,5 11,5 10.2,6 9.9,6.1 R21.1
LED_MOTOR_ARM
  Top 0.254: U10.36 39.27,32.03 38.35,31.9 37.26,31.27 37.26,29.5 36.04,29.5 33.5,29.5 32.8,28.5 32.6,28.2 32.6,25.6 32.3,25.3 32.2,25.2 23.2,25.2 R20.1
LED_RC_CONNECT  (via drill 0.23)
  Top 0.203: v36.63,26.93 36.4,26.5 | 36.4,26.5 | 36.4,26.5 36.4,26.4 | v35.39,32.19 36.68,32.19 36.96,32.54 37.19,32.77 38.05,32.77 39.12,33.58 39.31,33.6 39.9,33.6 40,33.5 40.01,33.51 U10.33
  Top 0.254: 36.43,26.53 36.4,26.4 33.7,23.6 33.7,20.3 R18.1
  Bottom 0.203: v36.63,26.93 36.63,27.07 36.4,27.4 36.38,30.27 35.49,31.26 35.49,32.39 v35.39,32.19
LED_SNSR_FAIL
  Top 0.254: U10.3 52.57,27.03 55.3,24.2 57.1,24.2 57.2,24 R16.1
LED_SNSR_ONLINE
  Top 0.254: U10.2 52.37,26.53 55.4,23.5 55.6,23.4 R15.1
LED_WIFI_CONNECT
  Top 0.254: U10.50 42.51,23.31 42.3,23.1 39.7,23.1 37.6,23.9 36,23.9 34.8,23.2 34.8,21.7 35.3,20.7 35.8,20.6 35.95,20.45 | 35.95,20.45 36,20.4 | R17.1 35.95,20.45
LSM_WTM_IRQ  (via drill 0.23)
  Top 0.203: v41.3,33.2 41.2,33.1 41,33.1 40.9,33 40,33 U10.34
  Top 0.254: U1.5 36.9,10.9 36.9,11.3 36.4,11.8 v36,11.8
  Bottom 0.203: 34.6,13.2 | 34.6,13.2 33.1,14.7 33.1,19.7 33.4,20 35.9,20 37.6,21.7 37.6,26.5 39.1,28 39.1,30.5 39.8,31.2 40.77,32.1 v41.3,33.2
  Bottom 0.254: v36,11.8 34.6,13.2
N$1
  Top 0.2: U8.12 50.25,11.35 52.05,11.35 52.4,10.7 52.4,9.4 51.1,8.9 C5.1
N$2
  Top 0.24: C9.1 25.11,46.39 25.3,46.2 25.3,45.21 U11.47
N$3
  Top 0.24: U11.31 35.21,41.97 35.7,42.29 36.15,43.99 C8.1
N$4
  Top 0.2: U8.8 47.95,9.45 48,9.2 48,9.4 C5.2
N$5
  Top 0.254: U10.6 53.63,28.53 R1.2
N$6
  Top 0.254: U11.6 27.26,31.28 R3.1
N$7
  Top 0.2: U8.10 49.85,10.55 C11.2
N$8
  Top 0.24: U1.6 36.1,10.6 35.8,10.9 C16.2
N$9
  Top 0.254: R15.2 55.9,20.4 55.8,20.3 55.9,20.2 SNSR_ONLINE.C
N$10
  Top 0.254: U3.20 51.45,20.45 50.7,20.7 C12.2
N$11
  Top 0.2: U3.10 50.95,14.85 51.2,14.6 51.4,14.5 51.6,14 C13.2
N$12
  Top 0.2: C15.1 39.1,6.4 39.3,7 39.3,7.9 39.4,8 | 39.4,8 39.3,8 | U1.12 39.35,8.05 39.4,8
N$13
  Top 0.2: C15.2 40,7.95 U1.13
N$14
  Top 0.254: R16.2 SNSR_FAIL.C
N$15
  Top 0.254: ARMED.C R20.2
N$16  (via drill 0.2)
  Top 0.406: v74.5,27.3 R11.2
  Bottom 0.406: LIPO.3 66.5,46.8 72.3,41 73.7,41 74.5,40.1 v74.5,27.3
N$17  (via drill 0.2)
  Top 0.406: v75.3,31.4 73.6,31.4 R9.2
  Bottom 0.406: LIPO.2 68.97,45.53 72.6,41.7 74.2,41.7 75.3,40.35 v75.3,31.4 75.4,31.4
N$18
  Top 0.203: 20.1,34.8 21.4,36 21.4,36.8 21.7,37 22.79,37 | 22.8,37 22.79,37 | 22.79,37 U11.60 | R6.1 18.7,35.2 16.6,35.2 16.6,35.3 TP1.TP
  Top 0.254: R6.1 20.1,34.8
N$19
  Top 0.254: R17.2 WIFI.C
N$20
  Top 0.254: R18.2 RC.C
N$21
  Top 0.254: R19.2 POWER.C
N$22
  cutout Top: 45.6,12.7 49.1,12.7 49.1,9.2 45.5,9.2
N$23
  cutout Top: 35.7,11.1 40.6,11.1 40.6,7.8 40.6,7.6 35.6,7.6 35.6,11.1
N$24
  cutout Bottom: 35.6,11.1 40.4,11.1 40.7,10.8 40.7,7.7 40.6,7.6 35.9,7.6 35.7,7.8 35.7,10.8
N$25  (via drill 0.23)
  Top 0.203: U10.60 47.51,25.11 47.8,25.5 47.8,29.1 v47.6,29.6 | v51.2,35 53.2,35.5 54.7,36.1 55.4,36.3 | 55.4,36.3 55.1,36.2 55.4,36.3 | TP0.TP 57,37.1 56.5,37.1 55.8,36.4 R23.2 55.4,36.3 | 55.4,36.3
  Bottom 0.203: v47.6,29.6 47.6,31.9 48.1,32.4 | 48.1,32.4 | 48.1,32.4 51,35 v51.2,35
N$27
  Top 0.2: U2.14 60.52,16.93 C22.2
N$30
  Top 0.2: GPS_LOCK.C R21.2
N$31
  Top 0.203: C26.2 | C26.2
  Top 0.254: C26.2 43.01,37.41 42.5,36.9 U10.31
N$32
  Top 0.203: 38.07,26.53 C27.1 | C27.1
  Top 0.254: U10.47 38.07,26.53
NETMF_IRQ  (via drill 0.2)
  Top 0.24: U10.54 44.51,23.11 43.9,21.8 36.8,21.8 v36,22.5 | U11.15 31.76,31.84 31.8,31.6 v31.8,31.1
  Bottom 0.24: v36,22.5 36,22.8 36,23.9 36,30 35,31.1 v31.8,31.1
NETMFAUX1
  Top 0.254: U11.33 33.27,44.47 34.9,46.1 34.9,47.4 34.93,47.4 NETMF_AUX.3
NETMFAUX2
  Top 0.254: U11.34 31.76,46.57 NETMF_AUX.4
OSC_IN
  Top 0.254: 57.96,26.7 X2.P$1 59.56,25.1 C44.2
  Top 0.3: U10.5 52.97,28.03 53.67,26.7 57.96,26.7
OSC_OUT
  Top 0.254: X2.P$2 58.74,31.48 C45.2 | R1.1 56.04,28.04 56.21,28.21
  Top 0.3: 56.21,28.21 X2.P$2
PWM_IN_AUX1  (via drill 0.2)
  Top 0.24: v43.9,27.1 43.5,24.9 U10.52 | 43.5,24 U10.52 | U10.52
  Bottom 0.203: 58.1,21.9 52.7,27.9 | RADIO.5 65.94,11.84 65.85,11.95
  Bottom 0.24: 58.8,13.8 58.1,14.5 58.1,21.9 | 52.7,27.9 46.5,27.9 45.5,27.9 45.3,27.8 44.6,27.4 v43.9,27.1
  Bottom 0.254: 65.85,11.95 64.6,13.8 58.8,13.8
PWM_IN_AUX2  (via drill 0.2, 0.23)
  Top 0.203: v65.28,6.35 65.84,6.3 RADIO.6
  Top 0.24: v44.4,26.31 44,25 U10.53
  Bottom 0.203: 57.6,21.7 52.4,27.4 | 65.19,10.99 65.29,7.15 v65.28,6.35
  Bottom 0.24: 61.4,13.3 58.7,13.3 57.6,14.2 57.6,21.7 | 52.4,27.4 46.8,27.4 45.6,27.4 45.1,27.1 44.5,26.8 v44.4,26.31
  Bottom 0.254: 65.19,10.99 63.49,13.3 61.4,13.3
PWM_IN_AUX3  (via drill 0.23)
  Top 0.203: U10.27 44.51,34.74 44.86,34.19 47.8,34.19 48.16,33.93 48.16,30.94 v48.46,29.77 | RADIO.7 v71.02,7.32
  Bottom 0.203: v48.46,29.77 48.36,29.92 49.23,29.06 53.39,29.06 59.54,22.4 59.59,17.58 60.1,17.07 65.99,17.07 67.31,16 71.02,12.75 v71.02,7.32
PWM_IN_AUX4  (via drill 0.23)
  Top 0.203: U10.25 45.51,34.8 45.62,34.54 48.01,34.54 48.56,34.14 48.56,31.19 v48.87,30.53 | RADIO.8 73.56,7.11 v73.46,7.37
  Bottom 0.203: v48.87,30.53 48.92,30.18 49.78,29.41 53.7,29.41 60.05,22.5 60.05,17.88 60.4,17.48 66.09,17.48 71.48,13.11 71.48,7.82 71.98,7.37 v73.46,7.37
PWM_IN_PITCH  (via drill 0.2)
  Top 0.24: v45.1,22.7 45,22.6 45.4,23.1 45.5,23.4 U10.56 | 45.5,24.1 U10.56 | U10.56
  Bottom 0.203: RADIO.1 55.78,5.64 57.04,6.9
  Bottom 0.24: 57.04,6.9 57.09,10.45 56.69,11.35 54.7,12.9 54.7,20.7 53.6,22.3 47.1,22.3 46.3,22 45.7,22 v45.1,22.7
PWM_IN_ROLL  (via drill 0.2)
  Top 0.24: v46,22.7 U10.57
  Bottom 0.203: RADIO.2 58.32,5.83 58.38,5.89
  Bottom 0.24: 55.2,13.1 55.2,20.8 54.1,22.4 53.9,22.7 v46,22.7
  Bottom 0.254: 58.38,5.89 58.38,9.99 58.1,10.9 55.2,13.1
PWM_IN_THRTL  (via drill 0.2, 0.23)
  Top 0.2: v47.2,26.8 47.3,26.5 47.3,25.8 47,25.1
  Top 0.203: v64.11,6.2 61.82,6.25 60.86,5.28 RADIO.3
  Top 0.24: 47,25.1 47,24.42 U10.59
  Bottom 0.203: 52.4,26.6 57,21.5 | 64.13,10.85 64.13,6.93 v64.11,6.2
  Bottom 0.24: 60.2,12.8 58.5,12.8 57.1,13.9 57.1,21.1 | 52.1,26.9 47.5,26.9 47.2,26.6 v47.2,26.8
  Bottom 0.254: 64.13,10.85 62.88,12.8 60.2,12.8 | 52.1,26.9 52.4,26.6 | 57,21.5 57.1,21.3 57.1,21.1
PWM_IN_YAW  (via drill 0.2)
  Top 0.24: v46.51,25.43 46.51,25.59 46.5,25 U10.58
  Bottom 0.203: 56.6,21.1 54.2,23.9 52.8,25.4 52.2,26.1 | RADIO.4 63.4,10.07 63.37,10.2
  Bottom 0.24: 60.4,12.3 58.4,12.3 56.6,13.7 56.6,21.1 | 52.2,26.1 51.8,26.5 49.34,26.5 48.2,26.5 47.6,26.2 46.7,25.7 46.57,25.63 v46.51,25.43
  Bottom 0.254: 63.37,10.2 62.02,12.3 60.4,12.3
PWM_OUT_AUX1  (via drill 0.2)
  Top 0.24: AUX-OUT1.1 43.16,48.14 44.3,47 48.6,47 49.1,46.3 49.1,45.6 50,44.2 v50,43.5 | v44.84,32.84 44.83,32.49 44.83,30.45 45.23,28.54 45.13,25.77 44.95,25.56 U10.55
  Bottom 0.203: v50,43.5 50,41.8 51,41.4 51,37.5 45.74,32.99
  Bottom 0.24: 45.74,32.99 45.64,32.99 v44.84,32.84
PWM_OUT_AUX2  (via drill 0.2)
  Top 0.24: AUX-OUT2.1 48.56,48.14 48.64,48.06 49.05,47.55 49.65,46.75 49.65,45.6 50.6,44.25 v50.6,42.8 | v43.5,33.6 43.5,34.1 U10.29
  Bottom 0.203: v50.6,42.8 50.6,42.1 51.4,41.75 51.4,37.3 44.52,31.13
  Bottom 0.24: 44.52,31.13 43.47,32.14 v43.5,33.6
PWM_OUT_FRONT  (via drill 0.2)
  Top 0.24: FRONT.1 84,8.36 82.81,8.34 v81.36,6.65 | v44.6,28.1 41.6,31.5 40.08,31.5 U10.37
  Bottom 0.203: 58.6,22.2 52.9,28.3
  Bottom 0.24: v81.36,6.65 79.66,6.28 66.78,6.33 66.42,6.68 66.4,6.76 66.39,11.65 66.36,12.2 66.1,12.6 65.9,12.9 64.8,14.3 59.4,14.3 59,14.3 58.6,14.8 58.6,22.2 | 52.9,28.3 45.1,28.3 v44.6,28.1
PWM_OUT_LEFT  (via drill 0.2)
  Top 0.2: 55.2,41.4 48.8,41.4 47.5,41.7 40.5,41.7 38.91,41.2 38.87,41.16 38.84,41.16 38.86,38.41 39.3,37.97 v39.3,37.21 | v38.8,31.3 39.2,31 39.98,31 U10.38
  Top 0.24: 62.7,48.4 62.7,46.1 62,45.5 60.3,45.5 59.4,44.6 59.4,42.3 58.7,41.4 58,41.4 55.2,41.4
  Top 0.254: 80.14,47.96 79,48.8 63.1,48.8 62.7,48.4
  Top 0.406: LEFT.1 80.14,47.96
  Bottom 0.2: v39.3,37.21 38.3,35.7 38.3,31.5 38.7,31.2 v38.8,31.3
PWM_OUT_REAR  (via drill 0.2, 0.23)
  Top 0.203: U10.30 43.01,34.83 42.42,34.14 39.12,34.14 37.9,33.12 36.63,33.12 v36.32,32.87
  Top 0.24: U10.40 37.94,29.98 37.86,30 v37.96,29.95
  Top 0.305: v16.97,19.2 v13.85,21
  Bottom 0.203: v36.32,32.87 36.48,32.77 36.43,32.72
  Bottom 0.254: v37.96,29.95 36.9,31.51 36.43,32.72 36.07,32.92 35.44,33.04 34.62,33.09 34.39,33.07 29.8,33.04 | REAR.1 8.17,27.44 13.51,22.15 13.86,21.89 v13.85,21
  Bottom 0.305: 29.8,33.04 29.72,33.04 17.53,20.57 17.11,19.55 16.88,19.34 v16.97,19.2 | v13.85,21 13.92,21.74
PWM_OUT_RIGHT  (via drill 0.2)
  Top 0.24: v38.25,30.75 38.5,30.6 39.28,30.5 U10.39
  Top 0.305: RIGHT.1 38,2.3 34.8,2.3 34.8,6.9 34.4,7.4 33.6,7.4 33.1,7.9 33.1,11.2 32.6,11.7 v32.6,13.3
  Bottom 0.254: v32.6,13.3 32.7,20 33,20.4 35.7,20.4 37.2,22 37.2,26.7 38.1,27.7 38.6,28.2 38.6,30.4 38.3,30.7 v38.25,30.75
SPI1_NETMF_MISO  (via drill 0.2)
  Top 0.2: U10.22 47.01,36.69 46.55,37.4 46.1,38.3 46.05,38.75 v46,39.3 | U11.56 21.83,38.97 20.8,39.8 20.8,43 R22.1
  Top 0.24: U11.56 24.53,38.97 v25.25,38.85
  Bottom 0.24: v25.25,38.85 44.35,38.85 v46,39.3
SPI1_NETMF_MOSI  (via drill 0.2)
  Top 0.2: U10.23 46.51,36.49 46.5,36.7 46.25,37.05 45.59,38.56 v45.5,38.5
  Top 0.24: U11.57 24.3,38.47 24.4,38.4 v25.2,37.9
  Top 0.254: U11.57 21.43,38.47 20.3,39.6 20.3,41 20.3,41.2 20.31,41.89 20.3,42.99 R2.1
  Bottom 0.24: v45.5,38.5 44.95,38.4 26.05,38.4 v25.2,37.9
SPI1_NETMF_SCK  (via drill 0.2)
  Top 0.24: U11.55 25.73,39.47 26.1,39.1 v26.71,37.8 | v46.84,38.1 47.5,37 U10.21
  Bottom 0.24: v26.71,37.8 26.7,37.95 44.91,38 45.57,37.85 v46.84,38.1
SPI1_NETMF_SS  (via drill 0.2, 0.23)
  Top 0.2: U10.20 48.01,36.41 v48.3,36.8 | U11.14 31.26,33.74 31.8,34.3 35.1,34.3 35.8,33.6 37.9,33.6 38.81,34.51 40.07,34.5 v40.7,35.1
  Top 0.254: 31.8,34.3 31.79,34.3 v31.75,34.34
  Bottom 0.2: v48.3,36.8 47.9,36.5 46,34.9 40.81,35 40.8,35.1 v40.7,35.1
USART1_GPS_RX
  Top 0.203: U10.43 34.23,28.53 34,28.5
  Top 0.24: 34,28.5 33.5,27.8 33.5,25.1 31,22.4 30.9,22.4 28.8,22.4 28.3,21.8 28.3,7.1 29,6.4 30.74,6.4 U$4.2
USART1_GPS_TX
  Top 0.2: 29.7,5.2 30.8,5.2 30.8,4.3 U$4.1
  Top 0.24: U10.42 33.7,29 33.63,28.93 33.03,28.03 33.03,25.23 32.4,24.5 30.9,22.9 28.6,22.9 27.8,22.1 27.8,6.9 29.7,5.2
  Bottom 0.2: 31.87,3.93 30.81,3.93 U$4.1
  Bottom 0.305: DEBUG.1 31.87,3.93
USART2_WIFI_CTS  (via drill 0.2)
  Top 0.24: XBEE.16 78.5,19.7 78.5,20.3 v76.5,20.3 | v53.8,33.3 52.5,32.5 51.54,32.5 U10.14
  Bottom 0.24: v76.5,20.3 72.6,21.9 72.6,31.35 71.69,32.1 54.9,32.1 v53.8,33.3
USART2_WIFI_RTS  (via drill 0.2)
  Top 0.24: XBEE.12 70.6,20.4 70.7,20.4 71,20.9 v72.2,21.2 | U10.15 52.33,33.03 v52.9,33.5
  Bottom 0.24: v72.2,21.2 72.1,31 71.4,31.6 55.4,31.6 54.4,31.6 53.3,32.9 v52.9,33.5
USART2_WIFI_RX  (via drill 0.2)
  Top 0.2: 49.7,40.9 v49.3,40.8 | v49.6,37.2 49.5,36.54 U10.17
  Top 0.203: 58.1,40.9 49.7,40.9 | v49.3,40.8 48.2,41.1 47.4,41.3 41,41.3 v39.69,40.7 | U11.38 29.76,43.14 v29.8,42.4
  Top 0.24: XBEE.2 83.2,38.8 82,40.8 82,42.6 81.1,43.9 69.5,43.9 69,43.5 69,42.6 66,40.5 65.3,40 60,40 58.1,40.9
  Bottom 0.2: v49.3,40.8 49.7,40.8 50.6,40.6 50.6,37.8 v49.6,37.2
  Bottom 0.203: v39.69,40.7 40.1,41.04 39.09,42.3 30.2,42.3 29.95,42.45 v29.8,42.4
USART2_WIFI_TX  (via drill 0.2)
  Top 0.24: XBEE.3 82.8,42.3 81.3,44.3 69,44.3 68.4,43.7 68.4,42.8 65.2,40.5 61.2,40.5 60.3,40.5 v60,40.9 | U10.16 52.01,33.51 52.4,34.1 v53.3,34.3
  Bottom 0.305: v53.3,34.3 56.2,35.1 56.2,36.9 56.2,40.3 57,40.9 59.5,40.9 | 59.5,40.9 | 59.5,40.9 v60,40.9
USART4_RX  (via drill 0.23)
  Top 0.203: U11.52 21.63,40.97 v21.4,41
  Bottom 0.203: v21.4,41 21.4,42.3 19.9,43.95 14.6,43.95 14.2,43.5 14.07,43.37 AUX_SER1.3
USART4_TX
  Top 0.203: U11.51 21.83,41.47 21.6,41.7 21.6,42.6 22.3,43.3 22.3,44.4 22.2,44.6 18.6,44.6 16.6,43.5 16.6,41.6 16.61,41.59 AUX_SER1.2
USB_DM
  Top 0.254: USB1.D- 8.33,35.87 8.7,35.6 10.93,35.57 11.9,34.8 11.9,33.3 R4.1
USB_DM_IN  (via drill 0.2, 0.23)
  Top 0.203: v26.4,26.3 26,26.5 23.9,26.5 23.6,26.8 20,26.8 19.9,27.4 19,28.2 17.8,28.2 17.5,28.5 17.5,30.7 16.9,31.4 16.4,31.4 16.2,31.5 16.2,32.6 16,33.1 v15.49,33.11 R4.2
  Top 0.254: v15.49,33.11 v15.5,33.1
  Bottom 0.203: SJ1.2 27.1,28.4 v26.4,26.3 | SJ3.1 18.34,34.95 16.46,33.07 15.7,33.07 | 15.7,33.07 15.54,33.07 15.49,33.12 | v15.49,33.11 15.66,33.11 15.7,33.07
USB_DM_IN1  (via drill 0.2)
  Top 0.254: v27.1,42.9 26.8,43.2 26.8,43.23 U11.44
  Bottom 0.203: SJ3.2 20.47,36.81 25.7,43.15
  Bottom 0.254: 25.7,43.15 26.8,43.1 v27.1,42.9
USB_DM_IN2  (via drill 0.23)
  Top 0.203: U10.44 35.03,28.03 v34.6,27.9
  Bottom 0.203: v34.6,27.9 34.5,28 30.6,28 30.2,28.4 SJ1.1
USB_DP
  Top 0.254: USB1.D+ 10.53,35.07 11.3,34.6 11.3,31.75 R5.1
USB_DP_IN  (via drill 0.2, 0.23)
  Top 0.203: v25,25.85 23.7,25.85 23.2,26.4 19.8,26.4 19.6,26.5 19.5,26.7 19.5,27 18.8,27.7 17.6,27.7 17.1,28.2 17.1,30.5 16.8,30.9 v15.4,30.9 | v15.4,30.9 | v15.4,30.9 | R5.2
  Top 0.254: v15.4,30.9 R5.2 13.7,30.9
  Bottom 0.203: v15.4,30.9 16.4,30.9 18.34,32.84 SJ4.1 | 25.1,26.1 v25,25.85 26.9,25.5 SJ2.2
USB_DP_IN1  (via drill 0.2)
  Top 0.254: U11.45 26.26,43.26 v26.1,42.5
  Bottom 0.203: SJ4.2 20.57,33.07 20.93,33.68 20.88,36.47 25.65,42.47 25.68,42.5 v26.1,42.5
  Bottom 0.254: v26.1,42.5 26.11,42.46 26.01,42.32 26.06,42.48
USB_DP_IN2  (via drill 0.23)
  Top 0.203: U10.45 35.73,27.53 v34.6,27
  Bottom 0.203: v34.6,27 33.2,27 31.7,25.5 SJ2.1 | SJ2.1
VIN
  Top 0.406: F2.P$2 69.3,34.7 70.1,35.5 74.3,35.5 76.1,33.7 76.1,30.7 76.6,30.2 U12.3
VIN_PROTECTED  (via drill 0.23)
  Top 0.406: v76,37.2 75.7,37.1 72.3,37.1 R7.2 | R7.2 69.5,36.5 F2.P$1 | R7.2
  Bottom 0.406: LIPO.1 71.41,44.19 73,42.4 74.8,42.4 76,40.55 76,37.7 76.05,37.14 v76,37.2
WIFI_RESET  (via drill 0.2)
  Top 0.203: XBEE.5 78.8,43.1 78.4,43.5 70,43.5 69.5,43.1 69.5,42.4 68.7,41.8 65.7,39.6 v48.8,39.6 | U10.26 45.01,36.09 44.9,36.4 44.6,37.1 v44.7,37
  Bottom 0.203: v44.7,37 44.75,37.35 46.25,37.35 46.6,37.3 47.15,37.51 48.75,39.01 v48.8,39.6
WIFLY_AP  (via drill 0.2)
  Top 0.203: v69.82,40.79 69.84,40.84 XBEE.9
  Bottom 0.24: AP.2 79.4,12.8 79.4,23 73.8,25.3 73.8,36.7 72.24,37.76 v69.82,40.79
XTAL3
  Top 0.203: C6.1 25.24,29.19 X1.P$1 25.15,28.9 26.4,29.8 26.76,30.16 U11.5
XTAL4
  Top 0.254: C7.1 31.35,28.99 31.46,28.84 30.66,28.8 X1.P$2 R3.2
(copper drawn outside any net)
  shapes: Bottom area x2, Top area x7

## Text on the board
tNames: GND | 1 | 2 | 3 | W | TRG | 1 | TX | +5V | GND | ECHO | GND | +5V | RX | W | W | TX | - | + | W | W
bNames: NiVekQC / Rev E. / 6.14.2013 / / Software Logistics, LLC / Microelectronics Division